# EAGLE schematic Main-v3.0 (EAGLE 8.3.0)
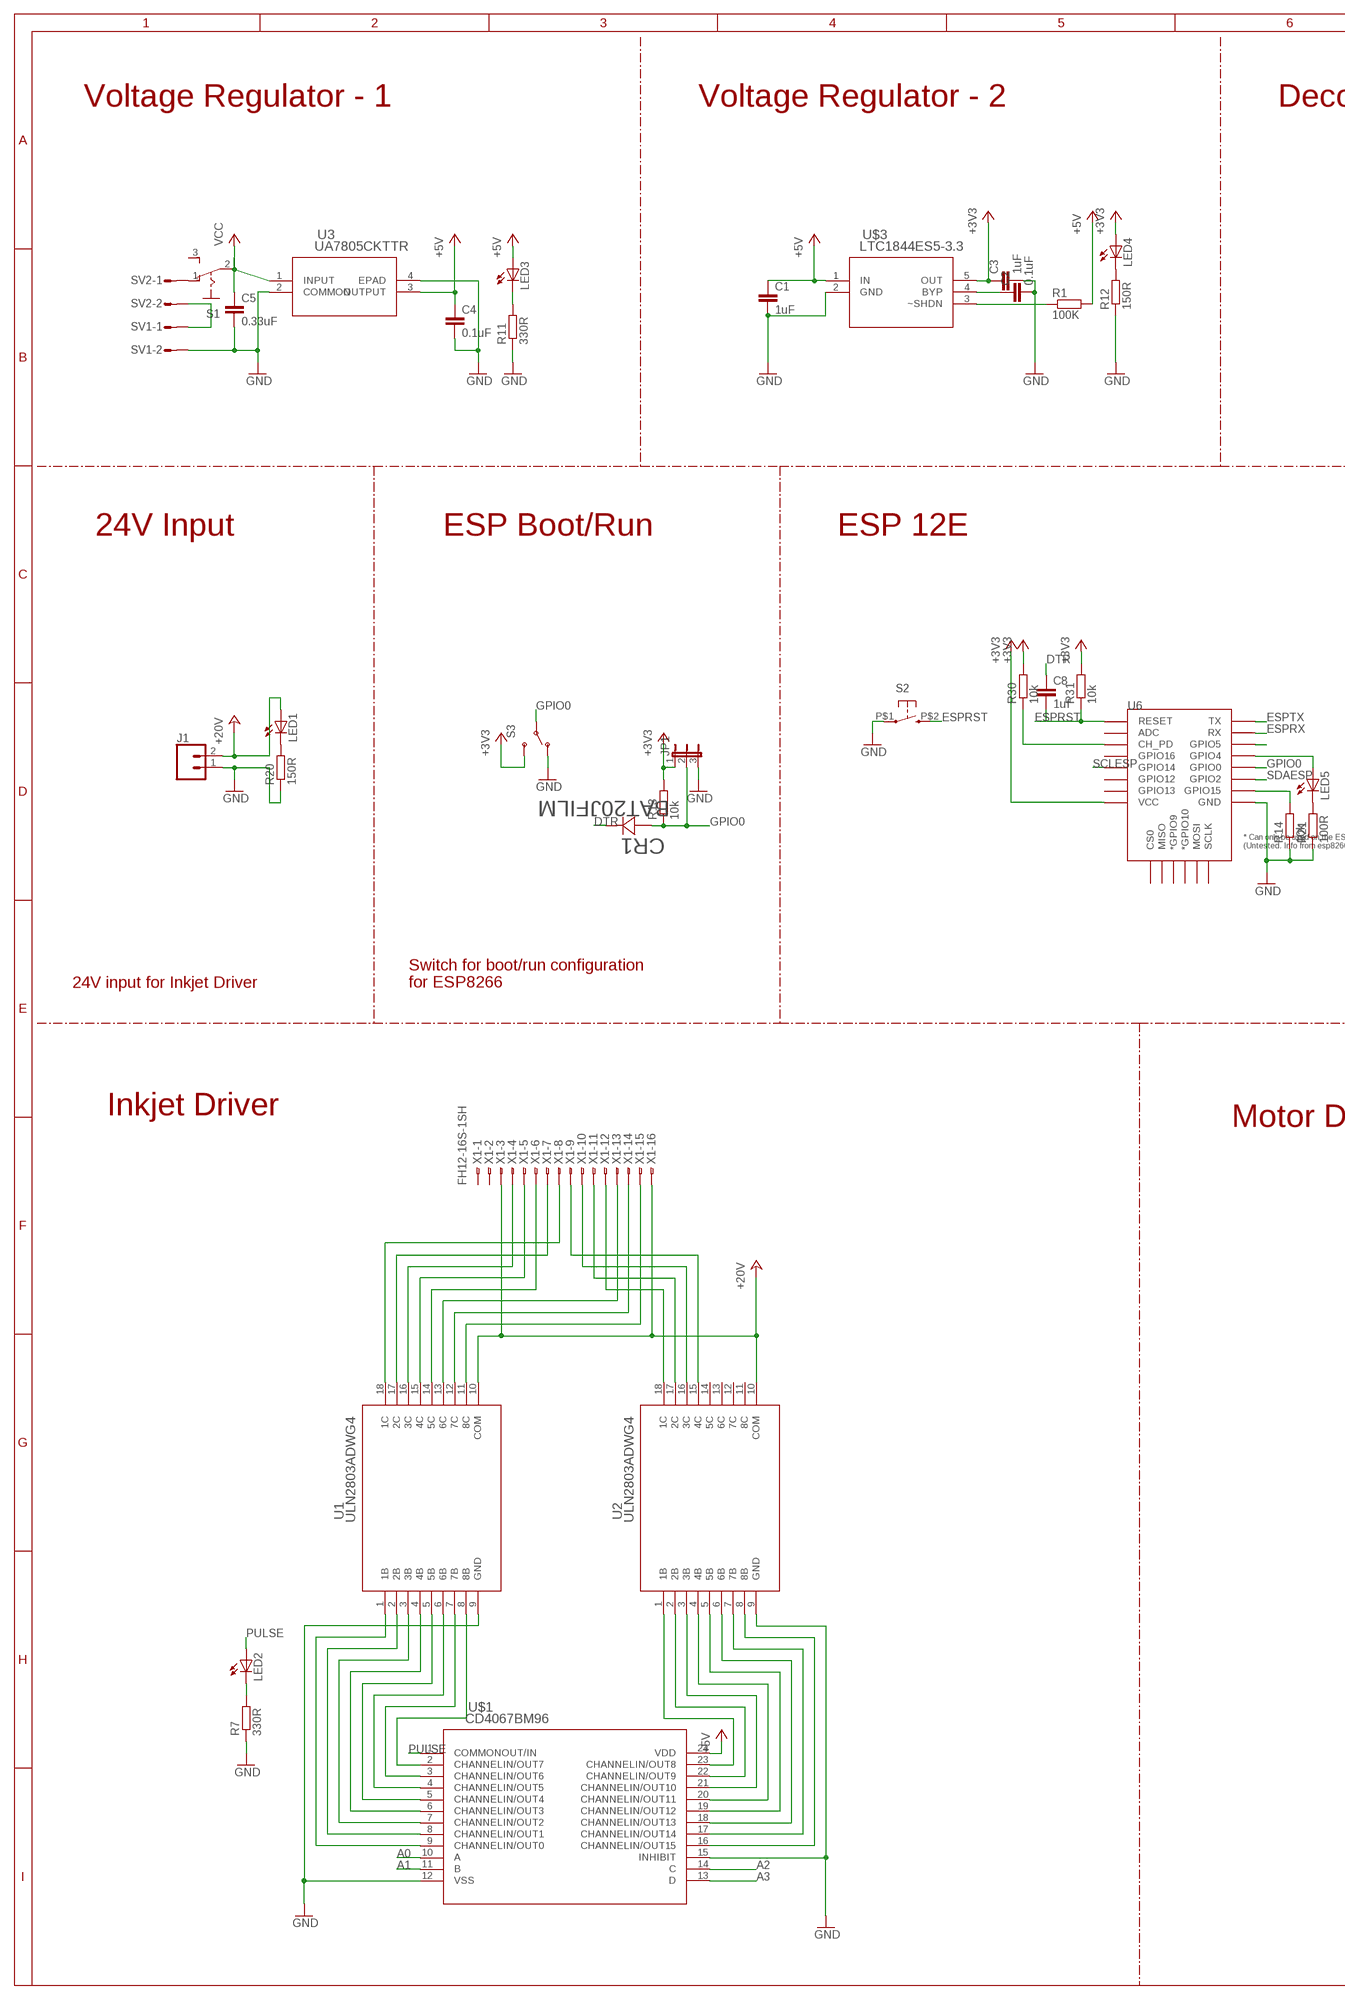
[diagram p0: schematic, sheet 1, part 1 of 2]
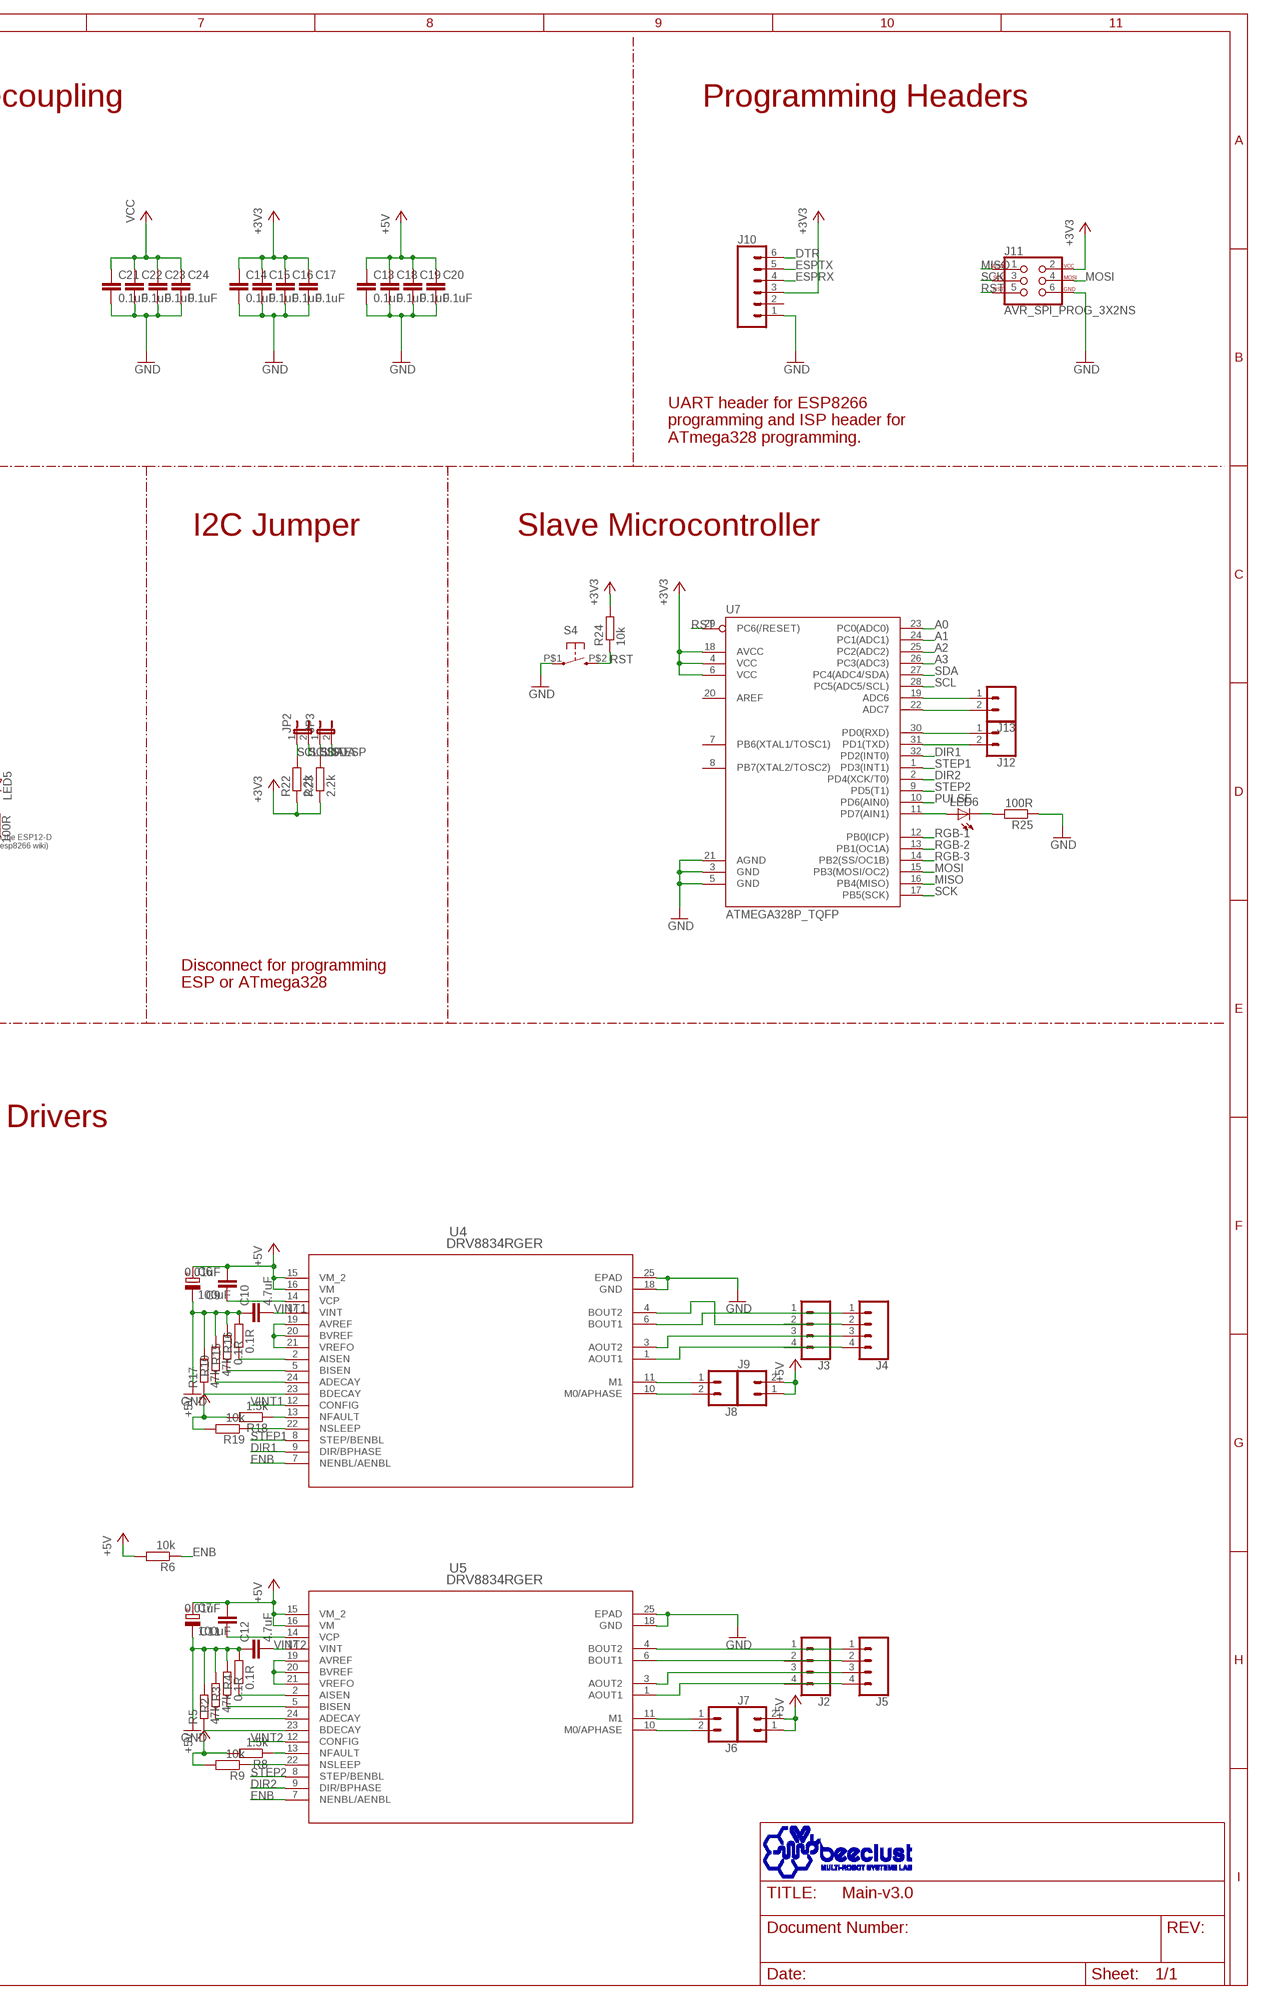
[diagram p1: schematic, sheet 1, part 2 of 2]

## Parts
C1  1uF  C-EUC0603  [C0603]
C2  0.1uF  C-EUC0603  [C0603]
C3  1uF  C-EUC0603  [C0603]
C4  0.1uF  C-EUC0603  [C0603]
C5  0.33uF  C-EUC0603  [C0603]
C6  100uF  CPOL-EUE5-5  [E5-5]
C7  100uF  CPOL-EUE5-5  [E5-5]
C8  1uf  C-EUC0603  [C0603]
C9  0.01uF  C-EUC0603K  [C0603K]
C10  4.7uF  C-EUC0603K  [C0603K]
C11  0.01uF  C-EUC0603K  [C0603K]
C12  4.7uF  C-EUC0603K  [C0603K]
C13  0.1uF  C-EUC0603  [C0603]
C14  0.1uF  C-EUC0603  [C0603]
C15  0.1uF  C-EUC0603  [C0603]
C16  0.1uF  C-EUC0603  [C0603]
C17  0.1uF  C-EUC0603  [C0603]
C18  0.1uF  C-EUC0603  [C0603]
C19  0.1uF  C-EUC0603  [C0603]
C20  0.1uF  C-EUC0603  [C0603]
C21  0.1uF  C-EUC0603  [C0603]
C22  0.1uF  C-EUC0603  [C0603]
C23  0.1uF  C-EUC0603  [C0603]
C24  0.1uF  C-EUC0603  [C0603]
CR1  BAT20JFILM  [SOD-323]
J1  CONN_02  [1X02]
J2  CONN_04  [1X04]
J3  CONN_04  [1X04]
J4  CONN_04  [1X04]
J5  CONN_04  [1X04]
J6  CONN_02  [1X02]
J7  CONN_02  [1X02]
J8  CONN_02  [1X02]
J9  CONN_02  [1X02]
J10  CONN_06NO_SILK_NO_POP  [1X06_NO_SILK]
J11  AVR_SPI_PROG_3X2NS  [2X3-NS]
J12  CONN_02  [1X02]
J13  CONN_02  [1X02]
JP1  JP2E  [JP2]
JP2  JP1E  [JP1]
JP3  JP1E  [JP1]
LED1  LEDSML0603  [SML0603]
LED2  LEDSML0603  [SML0603]
LED3  LEDSML0603  [SML0603]
LED4  LEDSML0603  [SML0603]
LED5  LEDSML0603  [SML0603]
LED6  LEDSML0603  [SML0603]
R1  100K  R-EU_R0603  [R0603]
R2  47k  R-EU_R0402  [R0402]
R3  0.1R  R-EU_R0402  [R0402]
R4  0.1R  R-EU_R0402  [R0402]
R5  47k  R-EU_R0402  [R0402]
R6  10k  R-EU_R0402  [R0402]
R7  330R  R-EU_R0603  [R0603]
R8  1.5k  R-EU_R0402  [R0402]
R9  10k  R-EU_R0402  [R0402]
R10  47k  R-EU_R0402  [R0402]
R11  330R  R-EU_R0603  [R0603]
R12  150R  R-EU_R0603  [R0603]
R13  10k  R-EU_R0603  [R0603]
R14  10k  R-EU_R0603  [R0603]
R15  0.1R  R-EU_R0402  [R0402]
R16  0.1R  R-EU_R0402  [R0402]
R17  47k  R-EU_R0402  [R0402]
R18  1.5k  R-EU_R0402  [R0402]
R19  10k  R-EU_R0402  [R0402]
R20  150R  R-EU_R0603  [R0603]
R21  100R  R-EU_R0603  [R0603]
R22  2.2k  R-EU_R0603  [R0603]
R23  2.2k  R-EU_R0603  [R0603]
R24  10k  R-EU_R0603  [R0603]
R25  100R  R-EU_R0603  [R0603]
R30  10k  R-EU_R0603  [R0603]
R31  10k  R-EU_R0603  [R0603]
S1  255SB  [255SB]
S2  KSS  [KSS]
S3  SWITCH-SPDT-SMD-A  [SWITCH-SPST-SMD-A]
S4  KSS  [KSS]
SV1  L02P  [L02P]
SV2  L02P  [L02P]
U1  ULN2803ADWG4  [DW18]
U2  ULN2803ADWG4  [DW18]
U3  UA7805CKTTR  [KTT3_6P22X6P6]
U4  DRV8834RGER  [RGE24_2P45X2P45]
U5  DRV8834RGER  [RGE24_2P45X2P45]
U6  ESP12ESMD  [ESP12E-SMD]
U7  ATMEGA328P_TQFP  [TQFP32-08]
U$1  CD4067BM96  [DW24]
U$2  BEECLUST-LOGO  [LOGO]
U$3  LTC1844ES5-3.3  [TSOT-23_S5]
X1  FH12-16S-1SH  [FH12-16S-1SH]

## Nets
+3V3: C3.1 C14.1 C15.1 C16.1 C17.1 J10.3 J11.2 JP1.1 LED4.A R13.2 R22.1 R23.1 R24.2 R30.2 R31.2 S3.3(S) U6.VCC U7.4(VCC) U7.6(VCC) U7.18(AVCC) U$3.5(OUT)
+5V: C1.1 C4.1 C6.+ C7.+ C9.2 C11.2 C13.1 C18.1 C19.1 C20.1 J7.1 J7.2 J9.1 J9.2 LED3.A R1.2 R6.2 R8.2 R9.2 R18.2 R19.2 U3.3(OUTPUT) U4.15(VM_2) U4.16(VM) U5.15(VM_2) U5.16(VM) U$1.24(VDD) U$3.1(IN)
+24V: J1.2 LED1.A U1.10(COM) U2.10(COM) X1.3 X1.16 ; supply symbol labelled +20V
A0: U7.23(PC0(ADC0)) U$1.10(A)
A1: U7.24(PC1(ADC1)) U$1.11(B)
A2: U7.25(PC2(ADC2)) U$1.14(C)
A3: U7.26(PC3(ADC3)) U$1.13(D)
DIR1: U4.9(DIR/BPHASE) U7.32(PD2(INT0))
DIR2: U5.9(DIR/BPHASE) U7.2(PD4(XCK/T0))
DTR: C8.1 CR1.1 J10.6
ENB: R6.1 U4.7(NENBL/AENBL) U5.7(NENBL/AENBL)
ESPRST: C8.2 R31.1 S2.P$2 U6.RESET
ESPRX: J10.4 U6.RXD0(RX)
ESPTX: J10.5 U6.TXD0(TX)
GND: C1.2 C2.2 C3.2 C4.2 C5.2 C6.- C7.- C10.1 C12.1 C13.2 C14.2 C15.2 C16.2 C17.2 C18.2 C19.2 C20.2 C21.2 C22.2 C23.2 C24.2 J1.1 J10.1 J11.6 JP1.3 R2.2 R3.2 R4.2 R5.2 R7.1 R10.2 R11.1 R12.1 R14.1 R15.2 R16.2 R17.2 R20.1 R21.1 R25.1 S2.P$1 S3.1(O) S4.P$1 SV1.2 U1.9(GND) U2.9(GND) U3.2(COMMON) U3.4(EPAD) U4.18(GND) U4.25(EPAD) U5.18(GND) U5.25(EPAD) U6.GND U7.3(GND) U7.5(GND) U7.21(AGND) U$1.12(VSS) U$1.15(INHIBIT) U$3.2(GND)
GPIO0: CR1.2 JP1.2 R13.1 S3.2(P) U6.GPIO0
MISO: J11.1 U7.16(PB4(MISO))
MOSI: J11.4 U7.15(PB3(MOSI/OC2))
N$1: SV1.1 SV2.2
N$2: U5.19(AVREF) U5.20(BVREF) U5.21(VREFO)
N$3: U1.8(8B) U$1.2(CHANNELIN/OUT7)
N$4: U1.7(7B) U$1.3(CHANNELIN/OUT6)
N$5: U1.6(6B) U$1.4(CHANNELIN/OUT5)
N$6: U1.5(5B) U$1.5(CHANNELIN/OUT4)
N$7: U1.4(4B) U$1.6(CHANNELIN/OUT3)
N$8: U1.3(3B) U$1.7(CHANNELIN/OUT2)
N$9: U1.2(2B) U$1.8(CHANNELIN/OUT1)
N$10: U1.1(1B) U$1.9(CHANNELIN/OUT0)
N$11: U2.1(1B) U$1.23(CHANNELIN/OUT8)
N$12: U2.2(2B) U$1.22(CHANNELIN/OUT9)
N$13: U2.3(3B) U$1.21(CHANNELIN/OUT10)
N$14: U2.4(4B) U$1.20(CHANNELIN/OUT11)
N$15: U2.5(5B) U$1.19(CHANNELIN/OUT12)
N$16: U2.6(6B) U$1.18(CHANNELIN/OUT13)
N$17: J3.1 J4.1 U4.6(BOUT1)
N$18: J3.2 J4.2 U4.4(BOUT2)
N$19: J3.3 J4.3 U4.3(AOUT2)
N$20: J3.4 J4.4 U4.1(AOUT1)
N$21: U1.11(8C) X1.15
N$22: U1.12(7C) X1.14
N$23: U1.13(6C) X1.13
N$24: U1.14(5C) X1.6
N$25: U1.15(4C) X1.5
N$26: U1.16(3C) X1.4
N$27: U1.17(2C) X1.7
N$28: U1.18(1C) X1.8
N$29: U2.8(8B) U$1.16(CHANNELIN/OUT15)
N$30: U2.18(1C) X1.12
N$31: U2.17(2C) X1.11
N$32: U2.16(3C) X1.10
N$33: U2.15(4C) X1.9
N$34: U2.7(7B) U$1.17(CHANNELIN/OUT14)
N$35: J2.1 J5.1 U5.4(BOUT2)
N$36: J2.2 J5.2 U5.6(BOUT1)
N$37: S1.1(O) SV2.1
N$38: C2.1 U$3.4(BYP)
N$39: R1.1 U$3.3(~SHDN)
N$40: J2.3 J5.3 U5.3(AOUT2)
N$41: J2.4 J5.4 U5.1(AOUT1)
N$42: C11.1 U5.14(VCP)
N$43: R5.1 U5.23(BDECAY)
N$44: R2.1 U5.24(ADECAY)
N$45: LED2.C R7.2
N$46: R3.1 U5.5(BISEN)
N$47: R4.1 U5.2(AISEN)
N$48: R9.1 U5.22(NSLEEP)
N$49: R8.1 U5.13(NFAULT)
N$50: LED3.C R11.2
N$51: LED4.C R12.2
N$52: R30.1 U6.CH_PD
N$53: U4.19(AVREF) U4.20(BVREF) U4.21(VREFO)
N$54: R17.1 U4.23(BDECAY)
N$55: LED6.C R25.2
N$56: LED5.C R21.2
N$57: LED6.A U7.11(PD7(AIN1))
N$65: R10.1 U4.24(ADECAY)
N$66: R15.1 U4.5(BISEN)
N$67: R16.1 U4.2(AISEN)
N$68: C9.1 U4.14(VCP)
N$73: R19.1 U4.22(NSLEEP)
N$74: R18.1 U4.13(NFAULT)
N$75: J6.2 U5.10(M0/APHASE)
N$76: J6.1 U5.11(M1)
N$77: J8.2 U4.10(M0/APHASE)
N$78: J8.1 U4.11(M1)
N$79: LED1.C R20.2
N$80: LED5.A U6.GPIO4
N$82: J13.1 U7.19(ADC6)
N$84: R14.2 U6.GPIO15
N$85: J13.2 U7.22(ADC7)
N$86: J12.1 U7.30(PD0(RXD))
N$87: J12.2 U7.31(PD1(TXD))
N$91: U6.GPIO5
PULSE: LED2.A U7.10(PD6(AIN0)) U$1.1(COMMONOUT/IN)
RGB-1: U7.12(PB0(ICP))
RGB-2: U7.13(PB1(OC1A))
RGB-3: U7.14(PB2(SS/OC1B))
RST: J11.5 R24.1 S4.P$2 U7.29(PC6(/RESET))
SCK: J11.3 U7.17(PB5(SCK))
SCL: JP2.2 U7.28(PC5(ADC5/SCL))
SCLESP: JP2.1 R22.2 U6.GPIO14
SDA: JP3.2 U7.27(PC4(ADC4/SDA))
SDAESP: JP3.1 R23.2 U6.GPIO2
STEP1: U4.8(STEP/BENBL) U7.1(PD3(INT1))
STEP2: U5.8(STEP/BENBL) U7.9(PD5(T1))
VCC: C5.1 C21.1 C22.1 C23.1 C24.1 S1.2(P) U3.1(INPUT)
VINT1: C10.2 U4.12(CONFIG) U4.17(VINT)
VINT2: C12.2 U5.12(CONFIG) U5.17(VINT)
Unconnected: J10.2 S1.3(S) U2.11(8C) U2.12(7C) U2.13(6C) U2.14(5C) U6.ADC U6.CS0 U6.GPIO9(*GPIO9) U6.GPIO10(*GPIO10) U6.GPIO12 U6.GPIO13 U6.GPIO16 U6.MISO U6.MOSI U6.SCLK U7.7(PB6(XTAL1/TOSC1)) U7.8(PB7(XTAL2/TOSC2)) U7.20(AREF) X1.1 X1.2

## Notes on the sheet
- Voltage Regulator - 1 | Voltage Regulator - 2 | Decoupling | Programming Headers
- UART header for ESP8266
  programming and ISP header for
  ATmega328 programming.
- 24V Input | ESP Boot/Run | ESP 12E | I2C Jumper | Slave Microcontroller
- 24V input for Inkjet Driver
- Switch for boot/run configuration
  for ESP8266
- Disconnect for programming
  ESP or ATmega328
- Inkjet Driver
- Motor Drivers

## Library data of the parts
C1-C5 C8-C24 = resistor:C-EU: CAPACITOR, European symbol
C6 C7 = resistor:CPOL-EU: POLARIZED CAPACITOR, European symbol
CR1 = Beeclust:BAT20JFILM; MANUFACTURER_PART_NUMBER: BAT20JFILM; VENDOR: ST Microelectronics
J1 J6-J9 J12 J13 = SparkFun-Connectors:CONN_02: Multi connection point. Often used as Generic Header-pin footprint for 0.1 inch spaced/style header connections On any of the 0.1 inch spaced packages, you can populate with these: Break Away Headers - Straight <https://www.sparkfun.com/products/116> (PRT-00116) Break Away Male Headers - Right Angle <https://www.sparkfun.com/products/553> (PRT-00553) Female Headers <https://www.sparkfun.com/products/115> (PRT-00115) Break Away Headers - Machine Pin <https://www.sparkfun.com/products/117> (PRT-00117) Break Away Female Headers - Swiss Machine Pin <https://www.sparkfun.com/products/743> (PRT-00743) For SCREWTERMINALS and SPRING TERMINALS visit here: Screw Terimnals on SparkFun.com <https://www.sparkfun.com/search/results?term=Screw+Terminals> (5mm/3.5mm/2.54mm spacing) This device is also useful as a general connection point to wire up your design to another part of your project. Our various solder wires solder well into these plated through hole pads. Hook-Up Wire - Assortment (Stranded, 22 AWG) <https://www.sparkfun.com/products/11375> (PRT-11375) Hook-Up Wire - Assortment (Solid Core, 22 AWG) <https://www.sparkfun.com/products/11367> (PRT-11367) View the entire wire category on our website here <https://www.sparkfun.com/categories/141> Special notes: Molex polarized connector foot print use with: PRT-08233 with associated crimp pins and housings. 2.54_SCREWTERM for use with PRT-10571. 3.5mm Screw Terminal footprints for PRT-08084 5mm Screw Terminal footprints for use with PRT-08432
J2-J5 = SparkFun-Connectors:CONN_04: Multi connection point. Often used as Generic Header-pin footprint for 0.1 inch spaced/style header connections On any of the 0.1 inch spaced packages, you can populate with these: Break Away Headers - Straight <https://www.sparkfun.com/products/116> (PRT-00116) Break Away Male Headers - Right Angle <https://www.sparkfun.com/products/553> (PRT-00553) Female Headers <https://www.sparkfun.com/products/115> (PRT-00115) Break Away Headers - Machine Pin <https://www.sparkfun.com/products/117> (PRT-00117) Break Away Female Headers - Swiss Machine Pin <https://www.sparkfun.com/products/743> (PRT-00743) For SCREWTERMINALS and SPRING TERMINALS visit here: Screw Terimnals on SparkFun.com <https://www.sparkfun.com/search/results?term=Screw+Terminals> (5mm/3.5mm/2.54mm spacing) This device is also useful as a general connection point to wire up your design to another part of your project. Our various solder wires solder well into these plated through hole pads. Hook-Up Wire - Assortment (Stranded, 22 AWG) <https://www.sparkfun.com/products/11375> (PRT-11375) Hook-Up Wire - Assortment (Solid Core, 22 AWG) <https://www.sparkfun.com/products/11367> (PRT-11367) View the entire wire category on our website here <https://www.sparkfun.com/categories/141> Special notes: Molex polarized connector foot print use with SKU : PRT-08231 with associated crimp pins and housings. 1MM SMD Version SKU: PRT-10208; PROD_ID: CONN-09696
J10 = SparkFun-Connectors:CONN_06: Multi connection point. Often used as Generic Header-pin footprint for 0.1 inch spaced/style header connections On any of the 0.1 inch spaced packages, you can populate with these: Break Away Headers - Straight <https://www.sparkfun.com/products/116> (PRT-00116) Break Away Male Headers - Right Angle <https://www.sparkfun.com/products/553> (PRT-00553) Female Headers <https://www.sparkfun.com/products/115> (PRT-00115) Break Away Headers - Machine Pin <https://www.sparkfun.com/products/117> (PRT-00117) Break Away Female Headers - Swiss Machine Pin <https://www.sparkfun.com/products/743> (PRT-00743) Arduino Stackable Header - 6 Pin <https://www.sparkfun.com/products/9280> (PRT-09280) For SCREWTERMINALS and SPRING TERMINALS visit here: Screw Terimnals on SparkFun.com <https://www.sparkfun.com/search/results?term=Screw+Terminals> (5mm/3.5mm/2.54mm spacing) This device is also useful as a general connection point to wire up your design to another part of your project. Our various solder wires solder well into these plated through hole pads. Hook-Up Wire - Assortment (Stranded, 22 AWG) <https://www.sparkfun.com/products/11375> (PRT-11375) Hook-Up Wire - Assortment (Solid Core, 22 AWG) <https://www.sparkfun.com/products/11367> (PRT-11367) View the entire wire category on our website here <https://www.sparkfun.com/categories/141>
J11 = SparkFun-Connectors:AVR_SPI_PROG_3X2: AVR ISP 6 Pin This is the reduced ISP connector for AVR programming. Common on Arduino. This footprint will take up less PCB space and can be used with a 10-pin to 6-pin adapter such as SKU: BOB-08508 **Special note about "TEST_POINT" package. The stop mask is on the top side, so if you want your programming test points to be on the bottom of your board, make sure to place this package on the bottom side of the board. This also ensure that the orientation to program from the bottom side will be correct. SparkFun Products: SparkFun ISP Pogo Adapter <https://www.sparkfun.com/products/11591> - NS Tiny AVR Programmer <https://www.sparkfun.com/products/11801> -PTH
JP1 = jumper:JP2E: JUMPER
JP2 JP3 = jumper:JP1E: JUMPER
LED1-LED6 = led:LED: LED OSRAM: - CHIPLED LG R971, LG N971, LY N971, LG Q971, LY Q971, LO R971, LY R971 LH N974, LH R974 LS Q976, LO Q976, LY Q976 LO Q996 - Hyper CHIPLED LW Q18S LB Q993, LB Q99A, LB R99A - SideLED LS A670, LO A670, LY A670, LG A670, LP A670 LB A673, LV A673, LT A673, LW A673 LH A674 LY A675 LS A676, LA A676, LO A676, LY A676, LW A676 LS A679, LY A679, LG A679 - Hyper Micro SIDELED® LS Y876, LA Y876, LO Y876, LY Y876 LT Y87S - SmartLED LW L88C, LW L88S LB L89C, LB L89S, LG L890 LS L89K, LO L89K, LY L89K LS L896, LA L896, LO L896, LY L896 - TOPLED LS T670, LO T670, LY T670, LG T670, LP T670 LSG T670, LSP T670, LSY T670, LOP T670, LYG T670 LG T671, LOG T671, LSG T671 LB T673, LV T673, LT T673, LW T673 LH T674 LS T676, LA T676, LO T676, LY T676, LB T676, LH T676, LSB T676, LW T676 LB T67C, LV T67C, LT T67C, LS T67K, LO T67K, LY T67K, LW E67C LS E67B, LA E67B, LO E67B, LY E67B, LB E67C, LV E67C, LT E67C LW T67C LS T679, LY T679, LG T679 LS T770, LO T770, LY T770, LG T770, LP T770 LB T773, LV T773, LT T773, LW T773 LH T774 LS E675, LA E675, LY E675, LS T675 LS T776, LA T776, LO T776, LY T776, LB T776 LHGB T686 LT T68C, LB T68C - Hyper Mini TOPLED® LB M676 - Mini TOPLED Santana® LG M470 LS M47K, LO M47K, LY M47K Source: http://www.osram.convergy.de LUXEON: - LUMILED® LXK2-PW12-R00, LXK2-PW12-S00, LXK2-PW14-U00, LXK2-PW14-V00 LXK2-PM12-R00, LXK2-PM12-S00, LXK2-PM14-U00 LXK2-PE12-Q00, LXK2-PE12-R00, LXK2-PE12-S00, LXK2-PE14-T00, LXK2-PE14-U00 LXK2-PB12-K00, LXK2-PB12-L00, LXK2-PB12-M00, LXK2-PB14-N00, LXK2-PB14-P00, LXK2-PB14-Q00 LXK2-PR12-L00, LXK2-PR12-M00, LXK2-PR14-Q00, LXK2-PR14-R00 LXK2-PD12-Q00, LXK2-PD12-R00, LXK2-PD12-S00 LXK2-PH12-R00, LXK2-PH12-S00 LXK2-PL12-P00, LXK2-PL12-Q00, LXK2-PL12-R00 Source: www.luxeon.com KINGBRIGHT: KA-3528ASYC Source: www.kingbright.com
R1-R25 R30 R31 = resistor:R-EU_: RESISTOR, European symbol
S1 = switch:255SB: SLIDING SWITCH Distributor Buerklin, 11G810
S2 S4 = adjacent-reality:KSS: KSS Series Subminiature SMT Side Actuated Momentary Tactile Switch
S3 = SparkFun-Electromechanical:SWITCH-SPDT: SPDT Switch Simple slide switch, Spark Fun Electronics SKU : COM-00102 DPDT SMT slide switch, AYZ0202, SWCH-08179; PROD_ID: SWCH-10651
SV1 SV2 = con-amp-mt:L02P: AMP MT CONNECTOR; OC_FARNELL: unknown; OC_NEWARK: unknown
U1 U2 = Beeclust:ULN2803ADWG4; MANUFACTURER_PART_NUMBER: ULN2803ADWG4; VENDOR: Texas Instruments
U3 = Beeclust:UA7805CKTTR; MANUFACTURER_PART_NUMBER: UA7805CKTTR; VENDOR: Texas Instruments
U4 U5 = Beeclust:DRV8834RGER; MANUFACTURER_PART_NUMBER: DRV8834RGER; VENDOR: Texas Instruments
U6 = esp8266modules:ESP12E: ESP12E Module
U7 = SparkFun-IC-Microcontroller:ATMEGA328P_TQFP: Popular 328P in QFP Storefront component: ATmega328 - TQFP <https://www.sparkfun.com/products/13448> (COM-13448) Datasheet <http://www.sparkfun.com/datasheets/Components/SMD/ATMega328.pdf> SparkFun Products SparkFun RedBoard - Programmed with Arduino <https://www.sparkfun.com/products/12757> (DEV-12757) Arduino Pro Mini 328 - 5V/16MHz <https://www.sparkfun.com/products/11113> (DEV-11113) Arduino Pro Mini 328 - 3.3V/8MHz <https://www.sparkfun.com/products/11114> (DEV-11114) SparkFun OpenLog <https://www.sparkfun.com/products/13712> (DEV-13712) SparkFun MicroView - OLED Arduino Module <https://www.sparkfun.com/products/12923> (DEV-12923) SparkFun Digital Sandbox <https://www.sparkfun.com/products/12651> (DEV-12651) SparkFun PicoBoard <https://www.sparkfun.com/products/11888> (WIG-11888) Arduino Fio <https://www.sparkfun.com/products/10116> (DEV-10116) LilyPad Arduino 328 Main Board <https://www.sparkfun.com/products/13342> (DEV-13342) SparkFun RedStick <https://www.sparkfun.com/products/13741> (DEV-13741) LilyPad MP3 <https://www.sparkfun.com/products/11013> (DEV-11013) LilyPad Arduino SimpleSnap <https://www.sparkfun.com/products/10941> (DEV-10941) SparkFun Stepoko <https://www.sparkfun.com/products/13899> (ROB-13899) SparkFun Geiger Counter <https://www.sparkfun.com/products/11345> (SEN-11345) SparkFun EL Sequencer <https://www.sparkfun.com/products/12781> (COM-12781) Arduino Pro 328 - 5V/16MHz <https://www.sparkfun.com/products/10915> (DEV-10915) CryptoCape <https://www.sparkfun.com/products/12773> (DEV-12773) SparkFun IR Thermometer Evaluation Board - MLX90614 <https://www.sparkfun.com/products/10740> (SEN-10740) SparkFun RedBot Mainboard <https://www.sparkfun.com/products/12097> (ROB-12097) Arduino Pro 328 - 3.3V/8MHz <https://www.sparkfun.com/products/10914> (DEV-10914) SparkFun Block for Intel® Edison - Arduino <https://www.sparkfun.com/products/13036> (DEV-13036) SparkFun Simon Says - Surface Mount Soldering Kit <https://www.sparkfun.com/products/10935> (KIT-10935) SparkFun 7-Segment Serial Display - Red <https://www.sparkfun.com/products/11441> (COM-11441) SparkFun 7-Segment Serial Display - White <https://www.sparkfun.com/products/11629> (COM-11629) SparkFun 7-Segment Serial Display - Yellow <https://www.sparkfun.com/products/11443> (COM-11443) SparkFun 7-Segment Serial Display - Kelly Green <https://www.sparkfun.com/products/11440> (COM-11440) SparkFun 7-Segment Serial Display - Blue <https://www.sparkfun.com/products/11442> (COM-11442) SparkFun OpenSegment Serial Display - 20mm (Blue) <https://www.sparkfun.com/products/11647> (COM-11647) SparkFun OpenSegment Serial Display - 20mm (Green) <https://www.sparkfun.com/products/11646> (COM-11646) SparkFun OpenSegment Serial Display - 20mm (White) <https://www.sparkfun.com/products/11648> (COM-11648) SparkFun OpenSegment Serial Display - 20mm (Red) <https://www.sparkfun.com/products/11644> (COM-11644) SparkFun OpenSegment Serial Display - 20mm (Yellow) <https://www.sparkfun.com/products/11645> (COM-11645) SparkFun OpenSegment Shield <https://www.sparkfun.com/products/13190> (DEV-13190); PROD_ID: IC-09069
U$1 = Beeclust:CD4067BM96; MANUFACTURER_PART_NUMBER: CD4067B_DW_24; VENDOR: Texas Instruments
U$2 = Beeclust:BEECLUST-LOGO
U$3 = Beeclust:LTC1844ES5-3.3
X1 = con-hirose:FH12-16S-1S: 1mm Pitch Connectors For FPC/FFC Source: Data sheet <http://www.hirose.co.jp/cataloge_hp/e58605370.pdf>; OC_FARNELL: unknown; OC_NEWARK: unknown